# EAGLE design Remote (EAGLE 9.6.2)
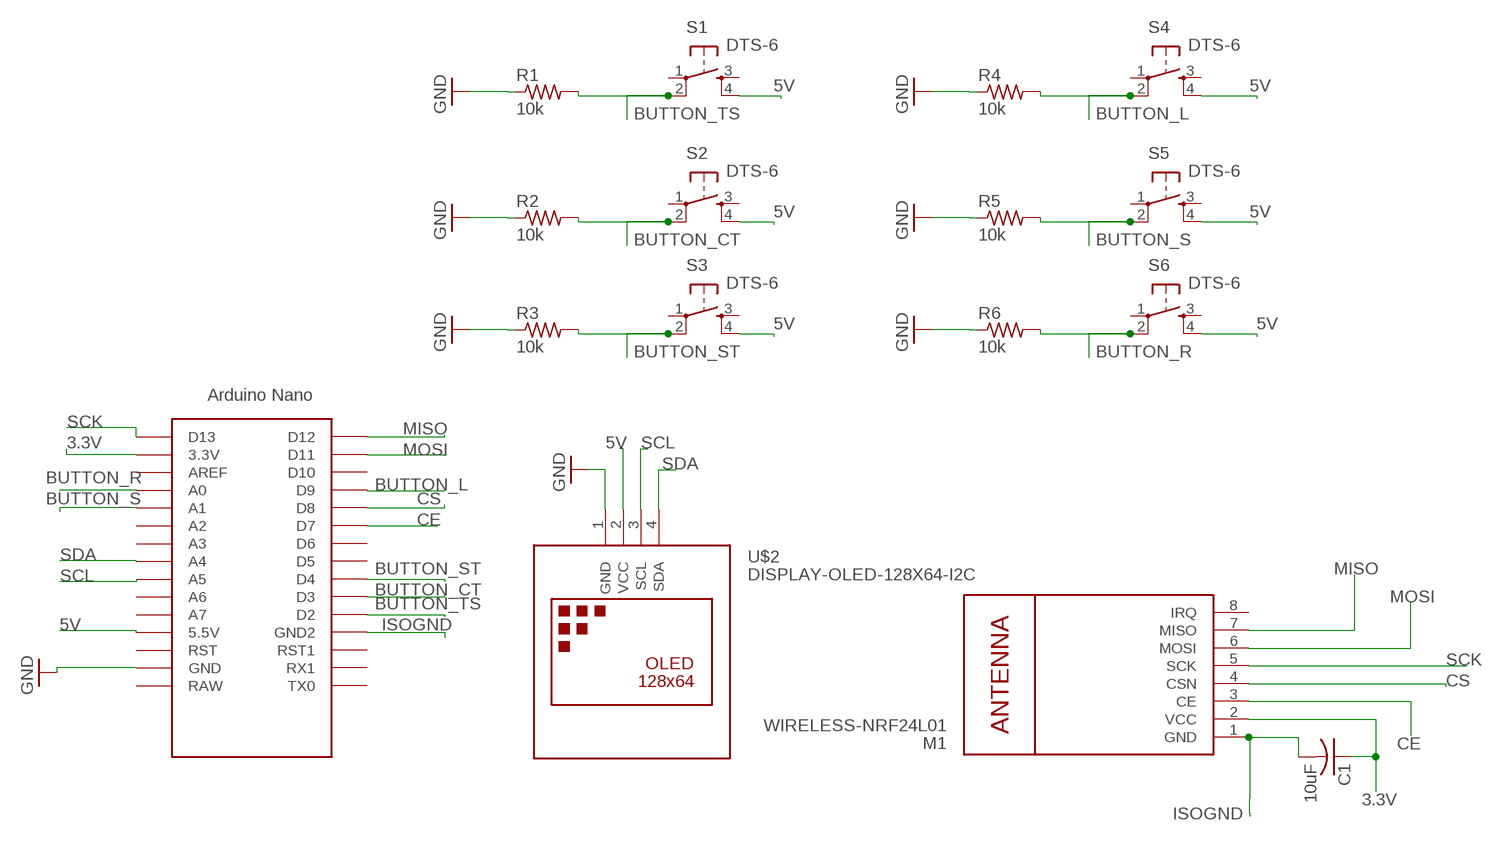
[diagram p0: schematic, sheet 1]

## Parts
C1  10uF  C-US025-030X050  [C025-030X050]
M1  WIRELESS-NRF24L01  [WIRELESS-NRF24L01]
R1  10k  R-US_0207/10  [0207/10]
R2  10k  R-US_0207/10  [0207/10]
R3  10k  R-US_0207/10  [0207/10]
R4  10k  R-US_0207/10  [0207/10]
R5  10k  R-US_0207/10  [0207/10]
R6  10k  R-US_0207/10  [0207/10]
S1  DTS-6  [DTS-6]
S2  DTS-6  [DTS-6]
S3  DTS-6  [DTS-6]
S4  DTS-6  [DTS-6]
S5  DTS-6  [DTS-6]
S6  DTS-6  [DTS-6]
U$1  NANO  [NANO]
U$2  DISPLAY-OLED-128X64-I2C  [DISPLAY-OLED-128X64-I2C]

## Nets
3.3V: C1.1 M1.2(VCC) U$1.3.3V
5V: S1.4 S2.4 S3.4 S4.4 S5.4 S6.4 U$1.5V(5.5V) U$2.2(VCC)
BUTTON_CT: R2.2 S2.2 U$1.D3
BUTTON_L: R4.2 S4.2 U$1.D9
BUTTON_R: R6.2 S6.2 U$1.A0
BUTTON_S: R5.2 S5.2 U$1.A1
BUTTON_ST: R3.2 S3.2 U$1.D4
BUTTON_TS: R1.2 S1.2 U$1.D2
CE: M1.3(CE) U$1.D7
CS: M1.4(CSN) U$1.D8
GND: R1.1 R2.1 R3.1 R4.1 R5.1 R6.1 U$1.GND U$2.1(GND)
ISOGND: C1.2 M1.1(GND) U$1.GND1(GND2)
MISO: M1.7(MISO) U$1.D12
MOSI: M1.6(MOSI) U$1.D11
SCK: M1.5(SCK) U$1.D13
SCL: U$1.A5 U$2.3(SCL)
SDA: U$1.A4 U$2.4(SDA)
Unconnected: M1.8(IRQ) S1.1 S1.3 S2.1 S2.3 S3.1 S3.3 S4.1 S4.3 S5.1 S5.3 S6.1 S6.3 U$1.A2 U$1.A3 U$1.A6 U$1.A7 U$1.AREF U$1.D5 U$1.D6 U$1.D10 U$1.ICSP1 U$1.ICSP2 U$1.ICSP3 U$1.ICSP4 U$1.ICSP5 U$1.ICSP6 U$1.RAW U$1.RST U$1.RST1 U$1.RX1 U$1.TX0

## Library data of the parts
C1 = rcl:C-US: CAPACITOR, American symbol; SPICEPREFIX: C
M1 = diy-modules:WIRELESS-NRF24L01: 2.4 GHz Wireless Module based on NRF24L01 chip More details available here: http://www.electrodragon.com/w/NRF24L01 Click here to find device on ebay.com <http://www.ebay.com/sch/nrf24l01+arduino>
R1-R6 = rcl:R-US_: RESISTOR, American symbol; SPICEPREFIX: R
S1-S6 = switch-tact:DTS-6
U$1 = Arduino-clone:NANO: Arduino Nano
U$2 = diy-modules:DISPLAY-OLED-128X64-I2C: 128x64 Dot Matrix OLED Module based on SSD1306 chip Variant with I2C interface More details available here: http://www.instructables.com/id/Monochrome-096-i2c-OLED-display-with-arduino-SSD13/ SSD1306 datasheet: https://cdn-shop.adafruit.com/datasheets/SSD1306.pdf Click here to find device on ebay.com <http://www.ebay.com/sch/oled+display+128x64+iic> Note: There are two variants: I2C and SPI. Search for the proper version.

## Board
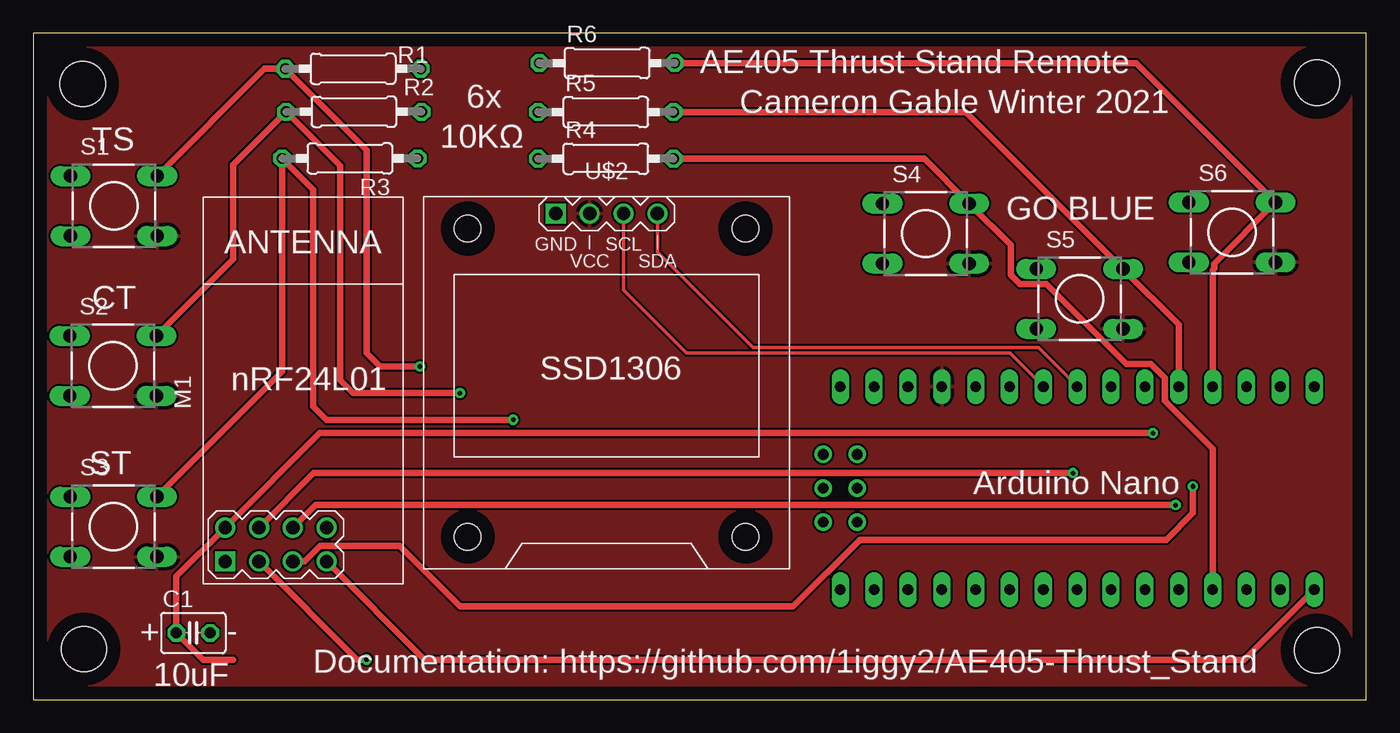
[diagram p1: board, top side]
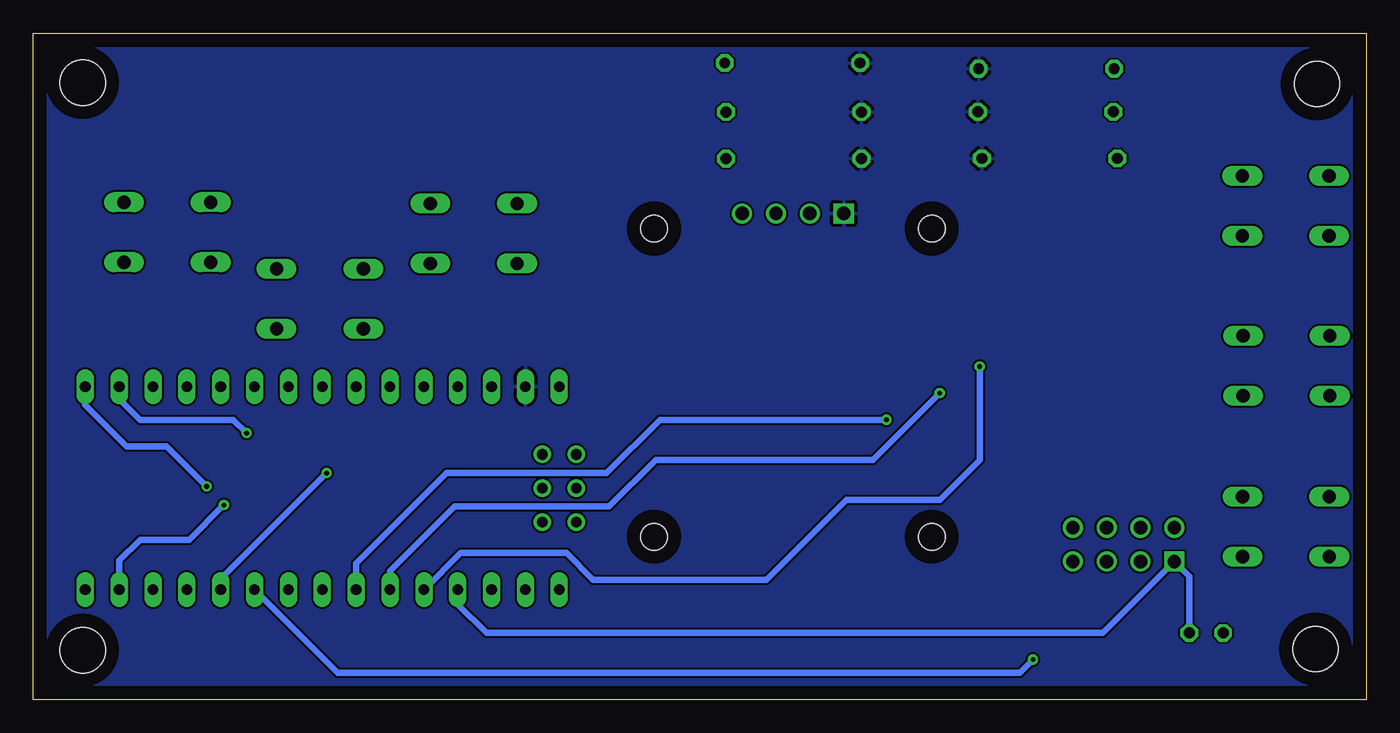
[diagram p2: board, bottom side, seen from below]

Size 100 x 50 mm. Coordinates in mm from the lower left corner, seen from the top.
Outline: 0,0 100,0 100,50 0,50 0,0
Copper layers (1*16): Top 0.035mm / dielectric 1.5mm / Bottom 0.035mm
Design rules "default": minimum track width 6mil, minimum drill 0.35mm, track to track 6mil, track to pad 6mil, pad to pad 6mil, via to via 6mil, smd to smd 6mil, copper to edge 40mil, drill to drill 6mil, minimum pad ring 10mil, minimum via ring 8mil, stop-mask expansion 4mil, vias tented up to drill 0mil, thermal gap 10mil
Holes 3.4 mm at 3.8,3.8 3.7,46.2 96.3,46.3 96.3,3.7

### Footprints (pad centres in the part's own frame; a part is rotated, then mirrored left to right if it is on the bottom)
C025-030X050 = drill 0.813 octagon: 1 -1.27,0; 2 1.27,0
WIRELESS-NRF24L01 = drill 1 square: 1 -12.7,6.35 | drill 1: 2 -10.16,6.35; 3 -12.7,3.81; 4 -10.16,3.81; 5 -12.7,1.27; 6 -10.16,1.27; 7 -12.7,-1.27; 8 -10.16,-1.27
0207/10 = drill 0.813 octagon: 1 -5.08,0; 2 5.08,0
DTS-6 = drill 1 long: 1 -3.25,2.25; 2 3.25,2.25; 3 -3.25,-2.25; 4 3.25,-2.25
NANO = drill 0.8 long: 3.3V -10.16,24.13; 5V -10.16,-1.27; A0 -10.16,19.05; A1 -10.16,16.51; A2 -10.16,13.97; A3 -10.16,11.43; A4 -10.16,8.89; A5 -10.16,6.35; A6 -10.16,3.81; A7 -10.16,1.27; AREF -10.16,21.59; D2 5.08,1.27; D3 5.08,3.81; D4 5.08,6.35; D5 5.08,8.89; D6 5.08,11.43; D7 5.08,13.97; D8 5.08,16.51; D9 5.08,19.05; D10 5.08,21.59; D11 5.08,24.13; D12 5.08,26.67; D13 -10.16,26.67; GND -10.16,-6.35; GND1 5.08,-1.27; RAW -10.16,-8.89; RST -10.16,-3.81; RST1 5.08,-3.81; RX1 5.08,-6.35; TX0 5.08,-8.89 | drill 0.8: ICSP1 -5.08,-10.16; ICSP2 -5.08,-7.62; ICSP3 -2.54,-10.16; ICSP4 -2.54,-7.62; ICSP5 0,-10.16; ICSP6 0,-7.62
DISPLAY-OLED-128X64-I2C = drill 1 square: 1 -3.81,12.7 | drill 1: 2 -1.27,12.7; 3 1.27,12.7; 4 3.81,12.7 | hole 2: -10.414,11.557; 10.414,11.557; 10.414,-11.557; -10.414,-11.557

### Placement (x,y rotation side)
C1  12,5 0 top
M1  20.74,23.06 90 top
R1  23.99,47.34 180 top
R2  24.05,44.11 180 top
R3  23.75,40.61 180 top
R4  42.95,40.59 0 top
R5  42.95,44.09 0 top
R6  43.05,47.77 0 top
S1  6.04,37.05 0 top
S2  5.98,25.05 0 top
S3  6.02,12.97 0 top
S4  66.96,34.97 0 top
S5  78.5,30.07 0 top
S6  89.94,35.07 0 top
U$1  69.43,13.32 270 top
U$2  43.01,23.78 0 top

### Tracks (layer width: path | path; a pad name or v marks a point on that pad's centre or on a via)
3.3V  (via drill 0.35)
  Top 0.5: 15,3 12.73,3 C1.1 10.73,9.24 M1.2 21.49,20 v84,20
  Bottom 0.5: v84,20 85,21 92,21 93.56,22.56 U$1.3.3V
5V
  pour Top: -1,52 102,52 102,-3 -3,-3 -3,52
BUTTON_CT  (via drill 0.35)
  Top 0.5: S2.2 15,33.07 15,40.14 R2.2 23,40.08 23,24 24,23 v32,23
  Bottom 0.5: v32,23 37,18 53.3,18 56.8,14.5 68.4,14.5 73.24,9.66 U$1.D3
BUTTON_L
  Top 0.5: R4.2 66.84,40.59 S4.2 73.34,34.09 73.34,31.84 74.02,31.16 76.02,31.16 81.99,25.19 83.84,25.19 84.88,24.14 84.88,22.39 88.48,18.79 U$1.D9
BUTTON_R
  Top 0.5: U$1.A0 88.48,32.22 88.6,32.34 88.6,32.73 S6.2 82.74,47.77 R6.2
BUTTON_S
  Top 0.5: U$1.A1 85.94,28.13 S5.2 69.98,44.09 R5.2
BUTTON_ST  (via drill 0.35)
  Top 0.5: S3.2 18.67,24.62 R3.2 21,38.28 21,22 22,21 v36,21
  Bottom 0.5: v36,21 53,21 57,17 69,17 75.78,10.22 U$1.D4
BUTTON_TS  (via drill 0.35)
  Top 0.5: S1.2 17.33,47.34 R1.2 25,41.25 25,26 26,25 v29,25
  Bottom 0.5: v29,25 29,18 32,15 39,15 45,9 58,9 60,11 67.94,11 U$1.D2
CE  (via drill 0.35)
  Top 0.5: M1.3 24.29,3 v25,3
  Bottom 0.5: v25,3 26,2 77.16,2 U$1.D7
CS  (via drill 0.35)
  Top 0.5: M1.4 21.03,17 v78,17
  Bottom 0.5: v78,17 85.94,9.06 U$1.D8
GND
  pour Bottom: -2,52 102,52 103,51 103,-1 102,-2 -3,-2 -3,51
ISOGND
  Bottom 0.5: C1.2 13.27,9.24 M1.1 19.75,5 66,5 68.16,7.16 U$1.GND1
MISO
  Top 0.5: M1.7 29.37,3 90.86,3 U$1.D12
MOSI  (via drill 0.35)
  Top 0.5: M1.6 21.17,14.6 v85.7,14.6
  Bottom 0.5: v85.7,14.6 88.3,12 92,12 93.56,10.44 U$1.D11
SCK  (via drill 0.35)
  Top 0.5: M1.5 20.38,10.36 21.53,11.52 27.48,11.52 32,7 57,7 62,12 85,12 87,14 v87,16
  Bottom 0.5: v87,16 90,19 93,19 96.1,22.1 U$1.D13
SCL
  Top 0.25: U$1.A5 73.26,26 49,26 44.28,30.72 U$2.3
SDA
  Top 0.25: U$1.A4 75.4,26.4 54,26.4 46.82,33.58 U$2.4

### Text on the board
tPlace: AE405 Thrust Stand Remote | 6x | Cameron Gable Winter 2021 | TS | 10KΩ | GO BLUE | CT | SSD1306 | nRF24L01 | ST | Arduino Nano | + | - | Documentation: https://github.com/1iggy2/AE405-Thrust_Stand | 10uF